# Altium schematic sheet 05-usb-Debugger.SchDoc: USB to Uart Bridge
size A4; DrawnBy: Trevor Charmley; Engineer: Trevor Charmley; DocumentNumber: 7; Revision: 1; SheetNumber: 7; SheetTotal: 8
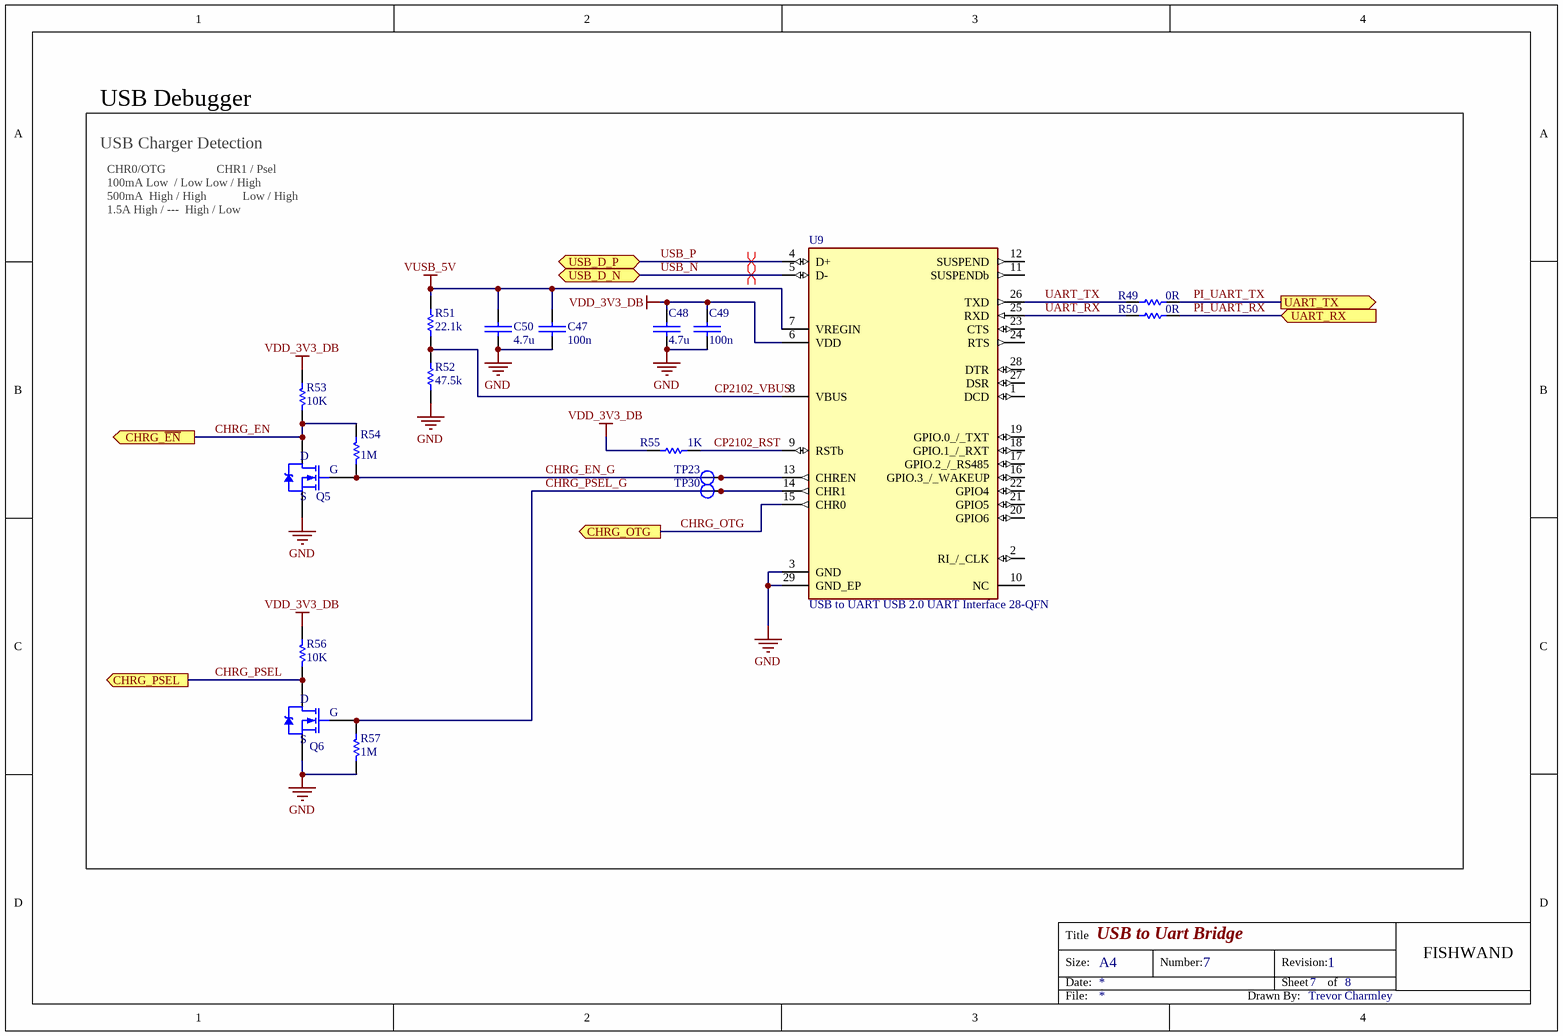
[diagram p0: 05-usb-Debugger.SchDoc]

## Parts
C47  100n  [CAPC100X50X65]
C48  4.7u  [CAPC100X50X65]
C49  100n  [CAPC100X50X65]
C50  4.7u  [CAPC100X50X65]
Q5  BSS138LT1G  [SOT23-3P95_240X111L42X43N]  (value not drawn)
Q6  BSS138LT1G  [SOT23-3P95_240X111L42X43N]  (value not drawn)
R49  0R  [RESC0402]
R50  0R  [RESC0402]
R51  22.1k  [RESC0402]
R52  47.5k  [RESC0402]  (net tie)
R53  10K  [RESC0402]
R54  1M  [RESC0402]
R55  1K  [RESC0402]
R56  10K  [RESC0402]
R57  1M  [RESC0402]
TP23  Test Point  [tp_1mm]  (value not drawn)  (no BOM)
TP30  Test Point  [tp_1mm]  (value not drawn)  (no BOM)
U9  USB to UART USB 2.0 UART Interface 28-QFN  [QFN50P500X500X80-29N]

## Ports
CHRG_OTG (out), CHRG_PSEL (out), CHRG_~{EN} (out), UART_RX (in), UART_TX (out), USB_D_N, USB_D_P

## Nets
GND: C47.2 C48.2 C49.2 C50.2 Q5.2(S) Q6.2(S) R52.1 R57.1 U9.3(GND) U9.29(GND_EP)
VDD_3V3_DB: C48.1 C49.1 R53.2 R55.1 R56.2 U9.6(VDD)
VUSB_5V: C47.1 C50.1 R51.2 U9.7(VREGIN)
CHRG_EN: Q5.3(D) R53.1 R54.2 ; port CHRG_~{EN}
CHRG_EN_G: Q5.1(G) R54.1 TP23.1 U9.13(CHREN)
CHRG_OTG: U9.15(CHR0) ; port CHRG_OTG
CHRG_PSEL: Q6.3(D) R56.1 ; port CHRG_PSEL
CHRG_PSEL_G: Q6.1(G) R57.2 TP30.1 U9.14(CHR1)
CP2102_RST: R55.2 U9.9(RSTb)
CP2102_VBUS: R51.1 R52.2 U9.8(VBUS)
PI_UART_RX: R50.2 ; port UART_RX
PI_UART_TX: R49.2 ; port UART_TX
UART_RX: R50.1 U9.25(RXD)
UART_TX: R49.1 U9.26(TXD)
USB_N: U9.5(D-) ; port USB_D_N
USB_P: U9.4(D+) ; port USB_D_P

Not connected (* = marked no-connect by the designer): U9 1(DCD) 2(RI_/_CLK) 10(NC) 11(SUSPENDb) 12(SUSPEND) 16(GPIO.3_/_WAKEUP) 17(GPIO.2_/_RS485) 18(GPIO.1_/_RXT) 19(GPIO.0_/_TXT) 20(GPIO6) 21(GPIO5) 22(GPIO4) 23(CTS) 24(RTS) 27(DSR) 28(DTR)

## Layout directives
differential pair: USB_N, USB_P

## Notes on the sheet
- USB Debugger
- USB Charger Detection
- CHR0/OTG	                CHR1 / Psel
  100mA	Low  / Low	Low / High
  500mA 	High / High           	Low / High
  1.5A	High / ---		High / Low
- Title
- Size:
- Date:
- A4
- Number:
- Revision:
- Sheet
- of
- FISHWAND
- File:
- Drawn By:

## Library data of the parts
C47 C49 = C_100NF_25V_X5R_0402: CAP CER 100nF 25V X5R 0402; Manufacturer: Murata Electronics; Manufacturer PN: GRM155R61E104KA87D; Supplier: Digi-Key; Supplier PN: 490-5920-2-ND
C48 C50 = C_4.7UF_10V_X5R_0402: CAP CER 4.7UF 10V X5R 0402; Manufacturer: Murata Electronics North America; Manufacturer PN: GRM155R61A475MEAAD; Supplier PN: 490-14306-1-ND
Q5 Q6 = TRANS_MOSFET_N_50V_200MA_SOT23: MOSFET N-CH 50V 200MA SOT-23; Manufacturer: ON Semiconductor; Manufacturer PN: BSS138LT1G; Type: MOSFET N-CH; Supplier PN: BSS138LT1GOSCT-ND
R49 R50 = R_0402_0R_5%: 0 Ohms Jumper 0.063W, 1/16W Chip Resistor 0402 (1005 Metric) Thick Film; Manufacturer: YAGEO; Manufacturer PN: RC0402JR-070RP; Tolerance: 5%; Supplier: *; Supplier PN: *; Value: 0R; Package / Case: 0402
R51 = RC0402FR-0722K1L: 22.1 kOhms ±1% 0.063W, 1/16W Chip Resistor 0402 (1005 Metric) Moisture Resistant Thick Film; Manufacturer: YAGEO; Value: 22K1; Manufacturer PN: RC0402FR-0722K1L; Supplier: *; Supplier PN: *; Tolerance: 1%; Package / Case: 0402
R52 = RC0402FR-0747K5L: 47.5 kOhms ±1% 0.063W, 1/16W Chip Resistor 0402 (1005 Metric) Moisture Resistant Thick Film; Manufacturer: YAGEO; Manufacturer PN: RC0402FR-0747K5L; Supplier: *; Supplier PN: *; Value: 47.5k; Tolerance: 1%; Package / Case: 0402
R53 R56 = R_0402_10K_1%: 10 kOhms ±1% 0.063W, 1/16W Chip Resistor 0402 (1005 Metric) Moisture Resistant Thick Film; Manufacturer: YAGEO; Manufacturer PN: RC0402FR-0710KL; Supplier: *; Supplier PN: *; Value: 10K; Tolerance: 1%; Package / Case: 0402
R54 R57 = R_0402_1M_1%: 1 MOhms ±1% 0.063W, 1/16W Chip Resistor 0402 (1005 Metric) Moisture Resistant Thick Film; Manufacturer: YAGEO; Manufacturer PN: RC0402FR-071ML; Supplier: Digi-Key; Supplier PN: 311-1.00MLRTR-ND; Value: 1M; Tolerance: 1%; Package / Case: 0402
R55 = RC0402FR-071KL: 1 kOhms ±1% 0.063W, 1/16W Chip Resistor 0402 (1005 Metric) Moisture Resistant Thick Film; Manufacturer: YAGEO; Value: 0R; Tolerance: 5%; Manufacturer PN: RC0402FR-071KL; Supplier: *; Supplier PN: *; Package / Case: 0402
TP23 TP30 = TP_1mm
U9 = USB to UART USB 2.0 UART Interface 28-QFN: USB Bridge, USB to UART USB 2.0 UART Interface 28-QFN (5x5); Manufacturer: Silicon Labs; Manufacturer PN: CP2102N-A02-GQFN28; Value: *; Price: None; Mouser-Purchase-URL: https://www.mouser.com/ProductDetail/Silicon-Labs/CP2102N-A02-GQFN28?qs=u16ybLDytRaSBkSkyjYFiA%3D%3D; Supplier: Mouser; Supplier PN: 634-CP2102NA02GQFN28; Package / Case: QFN-28